# EAGLE design hardware-ble-led-driver-ws2812 (EAGLE 9.6.0)
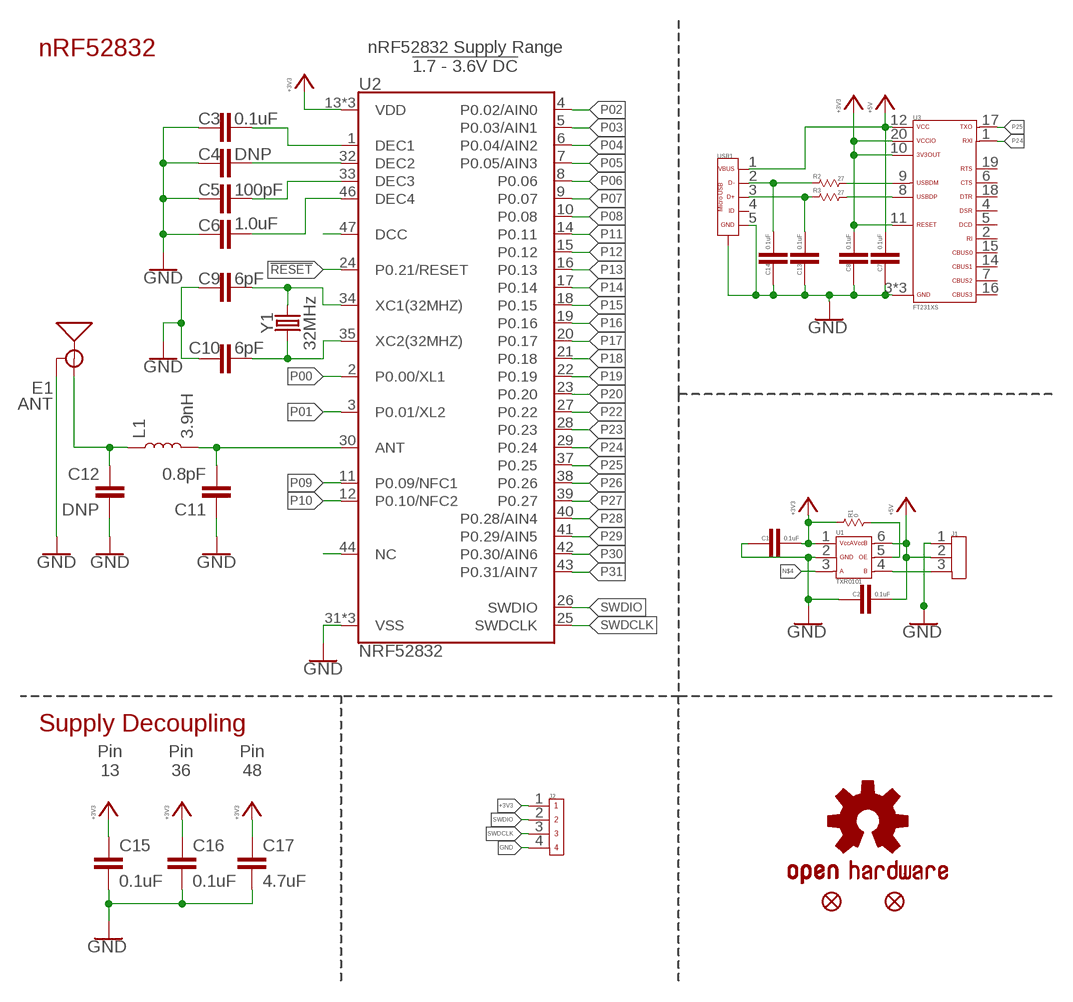
[diagram p0: schematic, sheet 1]

## Parts
C1  0.1uF  0.1UF-0402-16V-10%  [0402]
C2  0.1uF  0.1UF-0402-16V-10%  [0402]
C3  0.1uF  0.1UF-0402-16V-10%  [0402]
C4  DNP  CAP0402  [0402]
C5  100pF  100PF-0402-50V-5%  [0402]
C6  1.0uF  1.0UF-0402-16V-10%  [0402]
C7  0.1uF  0.1UF-0402-16V-10%  [0402]
C8  0.1uF  0.1UF-0402-16V-10%  [0402]
C9  6pF  6PF-0402-50V-0.5%  [0402]
C10  6pF  6PF-0402-50V-0.5%  [0402]
C11  0.8pF  0.8PF-0402-50V-0.1PF  [0402]
C12  DNP  CAP0402  [0402]
C13  0.1uF  0.1UF-0402-16V-10%  [0402]
C14  0.1uF  0.1UF-0402-16V-10%  [0402]
C15  0.1uF  0.1UF-0402-16V-10%  [0402]
C16  0.1uF  0.1UF-0402-16V-10%  [0402]
C17  4.7uF  4.7UF0603  [0603]
E1  ANT  ANTENNA-GROUNDEDTRACE-15.2MM  [TRACE_ANTENNA_2.4GHZ_15.2MM]
FD1  FIDUCIALUFIDUCIAL  [FIDUCIAL-MICRO]
FD2  FIDUCIALUFIDUCIAL  [FIDUCIAL-MICRO]
J1  3PIN_HEADER_PITCH2.54MM_TH  [3PIN_HEADER_PITCH2.54MM_TH]
J2  4PIN_HEADER_PITCH1.27MM_TH  [4PIN_HEADER_PITCH1.27MM_TH]
L1  3.9nH  INDUCTOR-0402-3.9NH  [0402]
LOGO1  OSHW-LOGOMINI  [OSHW-LOGO-MINI]
R1  0  RESISTOR_0402  [0402]
R2  27  RESISTOR_0402  [0402]
R3  27  RESISTOR_0402  [0402]
U1  TXB0101-DCK  [TSSOP-6]
U2  NRF52832  [QFN48-6X6MM]
U3  FT231XS_WFQFN20  [WFQFN-20]
USB1  USB-2.0-MICRO_SMD_SMD  [MICRO-USB-B-SMD-SMD]
Y1  32MHz  CRYSTAL-32MHZ-SMD-2.0X1.6MM  [CRYSTAL-SMD-2.0X1.6MM]

## Nets
!RESET!: U2.24(P0.21/RESET)
+3V3: C1.2 C8.2 C15.1 C16.1 C17.1 J2.1 R1.1 U1.1 U2.13(VDD) U2.36(VDD) U2.48(VDD) U3.10(3V3OUT) U3.11(RESET) U3.20(VCCIO)
+5V: C2.2 C7.2 J1.2 U1.6 U3.12(VCC) USB1.1(VBUS)
ANT: C11.2 L1.2 U2.30(ANT)
DCC: U2.47(DCC)
DEC1: C3.2 U2.1(DEC1)
DEC2: C4.2 U2.32(DEC2)
DEC3: C5.2 U2.33(DEC3)
DEC4: C6.2 U2.46(DEC4)
GND: C1.1 C2.1 C3.1 C4.1 C5.1 C6.1 C7.1 C8.1 C9.1 C10.2 C11.1 C12.2 C13.1 C14.1 C15.2 C16.2 C17.2 E1.GND J1.1 J2.4 U1.2 U2.31(VSS) U2.45(VSS) U2.EP(VSS) U3.3(GND) U3.13(GND) U3.T(GND) USB1.5(GND) USB1.M1(SHIELD) USB1.M2(SHIELD) USB1.M3(SHIELD) USB1.M4(SHIELD) USB1.S1(SHIELD) USB1.S2(SHIELD)
N$1: R2.2 U3.9(USBDM)
N$2: R1.2 U1.5
N$3: R3.2 U3.8(USBDP)
N$4: U1.3
N$5: J1.3 U1.4
N$9: C13.2 R3.1 USB1.3(D+)
N$10: C14.2 R2.1 USB1.2(D-)
N$11: C12.1 E1.ANT(SIGNAL) L1.1
NC: U2.44(NC)
P00: U2.2(P0.00/XL1)
P01: U2.3(P0.01/XL2)
P02: U2.4(P0.02/AIN0)
P03: U2.5(P0.03/AIN1)
P04: U2.6(P0.04/AIN2)
P05: U2.7(P0.05/AIN3)
P06: U2.8(P0.06)
P07: U2.9(P0.07)
P08: U2.10(P0.08)
P09: U2.11(P0.09/NFC1)
P10: U2.12(P0.10/NFC2)
P11: U2.14(P0.11)
P12: U2.15(P0.12)
P13: U2.16(P0.13)
P14: U2.17(P0.14)
P15: U2.18(P0.15)
P16: U2.19(P0.16)
P17: U2.20(P0.17)
P18: U2.21(P0.18)
P19: U2.22(P0.19)
P20: U2.23(P0.20)
P22: U2.27(P0.22)
P23: U2.28(P0.23)
P24: U2.29(P0.24) U3.1(RXD)
P25: U2.37(P0.25) U3.17(TXD)
P26: U2.38(P0.26)
P27: U2.39(P0.27)
P28: U2.40(P0.28/AIN4)
P29: U2.41(P0.29/AIN5)
P30: U2.42(P0.30/AIN6)
P31: U2.43(P0.31/AIN7)
SWDCLK: J2.3 U2.25(SWDCLK)
SWDIO: J2.2 U2.26(SWDIO)
XC1: C9.2 U2.34(XC1(32MHZ)) Y1.3
XC2: C10.1 U2.35(XC2(32MHZ)) Y1.1
Unconnected: U3.2(RI) U3.4(DSR) U3.5(DCD) U3.6(CTS) U3.7(CBUS2) U3.14(CBUS1) U3.15(CBUS0) U3.16(CBUS3) U3.18(DTR) U3.19(RTS) USB1.4(ID)

## Notes on the sheet
- nRF52832
- nRF52832 Supply Range
  !1.7 - 3.6V DC!
- Supply Decoupling
- Pin
  13
- Pin
  36
- Pin
  48

## Library data of the parts
C1-C3 C7 C8 C13-C16 = SparkFun-Capacitors:0.1UF: 0.1µF ceramic capacitors A capacitor is a passive two-terminal electrical component used to store electrical energy temporarily in an electric field.; PROD_ID: CAP-12416
C4 C12 = SparkFun-Passives:CAP: Capacitor Standard 0603 ceramic capacitor, and 0.1" leaded capacitor.
C5 = nrf52832-breakout-temp:100PF: 100pF/0.1nF ceramic capacitors A capacitor is a passive two-terminal electrical component used to store electrical energy temporarily in an electric field.; PROD_ID: CAP-13458
C6 = SparkFun-Capacitors:1.0UF: 1µF ceramic capacitors A capacitor is a passive two-terminal electrical component used to store electrical energy temporarily in an electric field.; PROD_ID: CAP-12417
C9 C10 = nrf52832-breakout-temp:6PF: 15pF ceramic capacitors A capacitor is a passive two-terminal electrical component used to store electrical energy temporarily in an electric field.; PROD_ID: CAP-13455
C11 = nrf52832-breakout-temp:0.8PF: 0.8pF ceramic capacitors A capacitor is a passive two-terminal electrical component used to store electrical energy temporarily in an electric field.; PROD_ID: CAP-13456
C17 = SparkFun-Capacitors:4.7UF: 4.7µF ceramic capacitors A capacitor is a passive two-terminal electrical component used to store electrical energy temporarily in an electric field.; PROD_ID: CAP-08280
E1 = SparkFun-RF:ANTENNA-GROUNDED: Antenna w/ Ground Connection 2.4GHz antennae with signal and ground terminals. TRACE_ANTENNA_2.4GHZ_15.2MM - Meander Trace antenna 15.2 x 5.7mm footprint Based on layout from TI app note AN043 <http://www.ti.com/lit/an/swra117d/swra117d.pdf>. TRACE_ANTENNA_2.4GHZ_25.7MM - Inverted F trace antenna 25.7 x 7.5 mm footprint. Based on layout from TI design note DN0007 <http://www.ti.com/lit/an/swru120b/swru120b.pdf>.
FD1 FD2 = SparkFun-Aesthetics:FIDUCIAL: Fiducial Alignment Points Point-of-reference for pick-and-place machines and other optical instruments.
J1 = Connectors:3PIN
J2 = Connectors:4PIN
L1 = nrf52832-breakout-temp:INDUCTOR: Inductors Resist changes in electrical current. Basically a coil of wire. SparkFun Products: SparkFun Load Cell Amplifier - HX711 <https://www.sparkfun.com/products/13879> IOIO-OTG - V2.2 <https://www.sparkfun.com/products/13613>; PROD_ID: NDUC-13457
LOGO1 = SparkFun-Aesthetics:OSHW-LOGO: Open-Source Hardware (OSHW) Logo This logo indicates the piece of hardware it is found on incorporates a OSHW license and/or adheres to the definition of open source hardware found here: http://freedomdefined.org/OSHW
R1-R3 = Resistors:RESISTOR
U1 = Level-Shifters:TXB0101
U2 = SparkFun-RF:NRF52832: Nordic nRF52832 Bluetooth Smart/ANT/2.4GHz RF SoC The nRF52832 SoC is a powerful, highly flexible ultra-low power multiprotocol SoC ideally suited for Bluetooth® Smart ANT and 2.4GHz ultra low-power wireless applications. The nRF52832 SoC is built around a 32-bit ARM® Cortex™-M4F CPU with 512kB + 64kB RAM. The embedded 2.4GHz transceiver supports Bluetooth Smart, ANT and proprietary 2.4 GHz protocol stack. It is on air compatible with the nRF51 Series, nRF24L and nRF24AP Series products from Nordic Semiconductor. Datasheet <https://cdn.sparkfun.com/datasheets/Wireless/Bluetooth/nRF52832_PS_v1.0.pdf> SparkFun Products: SparkFun nRF52832 Breakout <https://www.sparkfun.com/products/13990>; PROD_ID: IC-13460
U3 = FTDI:FT231XS
USB1 = Connectors:USB-2.0-MICRO
Y1 = nrf52832-breakout-temp:CRYSTAL-32MHZ: 32MHz Crystal Digikey Example <http://www.digikey.com/product-detail/en/murata-electronics-north-america/XRCGB32M000F2P00R0/490-9769-1-ND/4952013> Frequency: 32MHz Frequency Stability: ±20ppm Frequency Tolerance: ±20ppm Load Capacitance: 6pF; PROD_ID: XTAL-13459

## Board
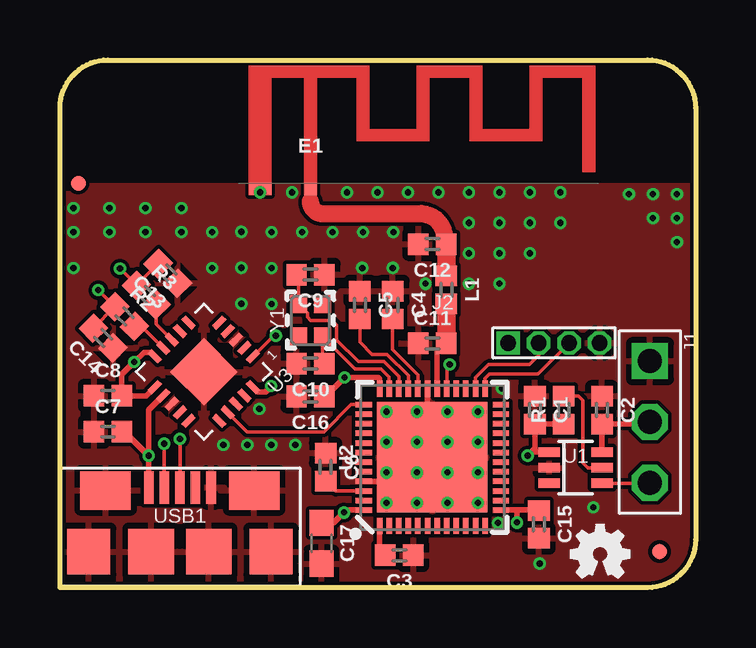
[diagram p1: board, top side]
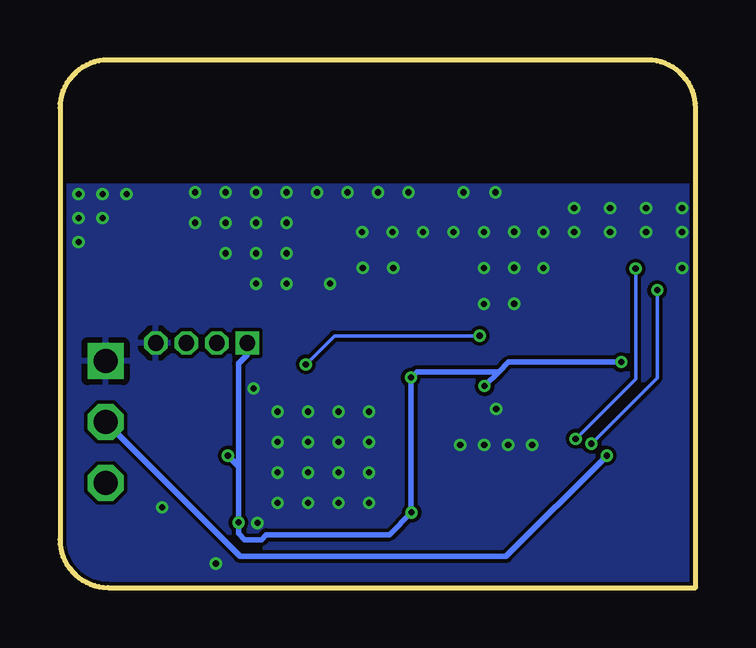
[diagram p2: board, bottom side, seen from below]

Size 26.5 x 22 mm. Coordinates in mm from the lower left corner, seen from the top.
Outline: 0,0 0,20 arc-90 2,22 24.5,22 arc-90 26.5,20 26.5,2 arc-90 24.5,0 0,0
Copper layers (1*16): Top 0.035mm / dielectric 1.5mm / Bottom 0.035mm
Design rules "SparkFun-2-layer-FAB-LIMIT *": minimum track width 4mil, minimum drill 6mil, track to track 6mil, track to pad 6mil, pad to pad 6mil, via to via 6mil, smd to smd 6mil, copper to edge 4mil, drill to drill 4mil, minimum pad ring 5mil, minimum via ring 5mil, stop-mask expansion 4mil, vias tented up to drill 25mil, thermal gap 10mil
tRestrict: 2 lines

### Footprints (pad centres in the part's own frame; a part is rotated, then mirrored left to right if it is on the bottom)
0402 = smd 0.85 x 0.9: 1 -0.58,0; 2 0.58,0
0603 = smd 1.1 x 1: 1 -0.85,0; 2 0.85,0
TRACE_ANTENNA_2.4GHZ_15.2MM = smd 0.5 x 0.5: ANT 0,-0.25 | smd 0.9 x 0.5: GND -2.1,-0.25
FIDUCIAL-MICRO = smd 0.635 x 0.635: 1 0,0
3PIN_HEADER_PITCH2.54MM_TH = drill 1 square: 1 -2.54,0 | drill 1 octagon: 2 0,0; 3 2.54,0
4PIN_HEADER_PITCH1.27MM_TH = drill 0.65 pad 0.9 square: 1 -1.905,0 | drill 0.65 pad 0.9 octagon: 2 -0.635,0; 3 0.635,0; 4 1.905,0
TSSOP-6 = smd 0.4 x 0.9: 1 -0.65,-1.1; 2 0,-1.1; 3 0.65,-1.1; 4 0.65,1.1; 5 0,1.1; 6 -0.65,1.1
QFN48-6X6MM = smd 0.68 x 0.23: 1 -2.86,2.2; 2 -2.86,1.8; 3 -2.86,1.4; 4 -2.86,1; 5 -2.86,0.6; 6 -2.86,0.2; 7 -2.86,-0.2; 8 -2.86,-0.6; 9 -2.86,-1; 10 -2.86,-1.4; 11 -2.86,-1.8; 12 -2.86,-2.2; 25 2.86,-2.2; 26 2.86,-1.8; 27 2.86,-1.4; 28 2.86,-1; 29 2.86,-0.6; 30 2.86,-0.2; 31 2.86,0.2; 32 2.86,0.6; 33 2.86,1; 34 2.86,1.4; 35 2.86,1.8; 36 2.86,2.2 | smd 0.23 x 0.68: 13 -2.2,-2.86; 14 -1.8,-2.86; 15 -1.4,-2.86; 16 -1,-2.86; 17 -0.6,-2.86; 18 -0.2,-2.86; 19 0.2,-2.86; 20 0.6,-2.86; 21 1,-2.86; 22 1.4,-2.86; 23 1.8,-2.86; 24 2.2,-2.86; 37 2.2,2.86; 38 1.8,2.86; 39 1.4,2.86; 40 1,2.86; 41 0.6,2.86; 42 0.2,2.86; 43 -0.2,2.86; 44 -0.6,2.86; 45 -1,2.86; 46 -1.4,2.86; 47 -1.8,2.86; 48 -2.2,2.86 | smd 4.6 x 4.6: EP 0,0
WFQFN-20 = smd 0.6 x 0.254: 1 -1.9,1; 2 -1.9,0.5; 3 -1.9,0; 4 -1.9,-0.5; 5 -1.9,-1; 11 1.9,-1; 12 1.9,-0.5; 13 1.9,0; 14 1.9,0.5; 15 1.9,1 | smd 0.254 x 0.6: 6 -1,-1.9; 7 -0.5,-1.9; 8 0,-1.9; 9 0.5,-1.9; 10 1,-1.9; 16 1,1.9; 17 0.5,1.9; 18 0,1.9; 19 -0.5,1.9; 20 -1,1.9 | smd 2 x 2: T 0,0
MICRO-USB-B-SMD-SMD = smd 0.4 x 1.35: 1 -1.3,2.675; 2 -0.65,2.675; 3 0,2.675; 4 0.65,2.675; 5 1.3,2.675 | smd 2.1 x 1.6: M1 -3.1,2.55; M2 3.1,2.55 | smd 1.8 x 1.9: M3 -3.8,0; M4 3.8,0 | smd 1.9 x 1.9: S1 -1.2,0; S2 1.2,0
CRYSTAL-SMD-2.0X1.6MM = smd 0.75 x 0.7: 1 -0.675,-0.5; 2 0.675,-0.5; 3 0.675,0.5; 4 -0.675,0.5

### Placement (x,y rotation side)
C1  19.8,7.4 270 top
C2  22.6,7.4 270 top
C3  14.15,1.35 180 top
C4  13.87,11.78 270 top
C5  12.5,11.78 270 top
C6  11.08,5.03 270 top
C7  2,6.5 0 top
C8  2,8 0 top
C9  10.45,13.05 180 top
C10  10.45,9.34 180 top
C11  15.53,10.18 0 top
C12  15.53,14.32 180 top
C13  4.5,13.1 135 top
C14  1.8,10.4 135 top
C15  19.97,2.64 270 top
C16  10.45,7.97 180 top
C17  10.9,1.85 270 top
E1  10.45,16.86 0 top
FD1  25,1.5 0 top
FD2  0.76,16.86 0 top
J1  24.6,6.9 270 top
J2  20.6,10.2 0 top
L1  16.11,12.41 270 top
LOGO1  22.52,1.41 0 top
R1  21,7.4 90 top
R2  2.7,11.3 315 top
R3  3.6,12.2 315 top
U1  21.5,5 270 top
U2  15.53,5.43 90 top
U3  6,9 225 top
USB1  5,1.5 0 top
Y1  10.45,11.14 90 top

### Tracks (layer width: path | path; a pad name or v marks a point on that pad's centre or on a via)
+3V3  (via drill 0.25)
  Top 0.229: U2.13 19.06,3.23 | 19.06,3.23 19.96,3.23 C15.1 | v19.06,2.71 19.06,3.23 | U2.36 13.32,8.69 13.26,8.76 v11.87,8.76 11.08,7.97 C16.1 | U2.48 11.94,3.23 v11.84,3.13 11.41,2.7 C17.1 | U3.20 8.26,8.15 8.57,8.15 8.8,8.39 v8.8,8.4 | U3.10 3.79,9.8 3.5,9.8 v3.1,9.4 2.58,8.88 C8.2 3.59,8 U3.11 | 19.95,5.65 U1.1 19.65,5.65 | R1.1 C1.2 19.8,5.8 19.65,5.65 | v19.5,5.5 19.65,5.65
  Bottom 0.229: v3.1,9.4 7.8,9.4 8.2,9 | 8.2,9 v8.8,8.4 | 8.2,9 11.62,9 v11.87,8.76 11.87,3.15 v11.84,3.13 12.77,2.2 17.9,2.2 18.1,2 18.8,2 19.06,2.26 v19.06,2.71 19.06,5.06 | v19.5,5.5 19.06,5.06 | J2.1 18.7,9.7 19.06,9.34 19.06,5.06
+5V  (via drill 0.25)
  Top 0.229: U3.12 3.7,7.41 v3.7,5.5 | v3.7,5.5 USB1.1 | C7.2 2.7,6.5 v3.7,5.5 | J1.2 24.52,6.82 C2.2 U1.6
  Bottom 0.229: J1.2 19,1.3 7.9,1.3 v3.7,5.5
ANT
  Top 0.229: U2.30 15.72,9.8 C11.2
  Top 0.762: C11.2 L1.2
DEC1
  Top 0.229: U2.1 13.32,1.59 C3.2
DEC2
  Top 0.152: U2.32 14.93,8.88 13.87,9.93 C4.2
DEC3
  Top 0.152: U2.33 14.53,8.84 13.64,9.72 13.01,9.72 12.5,10.23 C5.2
DEC4
  Top 0.152: U2.46 11.5,4.03 C6.2
GND  (via drill 0.25)
  Top 0.152: 15.32,5.63 v14.89,6.07
  Top 0.229: U2.31 15.32,5.63 U2.EP | U2.45 14.53,4.43 v14.89,4.79
  other vias: 8.35,16.48 12.6,13.33 13.87,13.33 15.25,12.67 17.05,12.67 7.56,14.83 18.27,2.69 20,1 16.16,4.79 16.16,3.52 16.16,6.07 16.16,7.33 14.89,7.33 14.89,3.52 13.62,3.52 13.62,4.79 13.62,6.07 13.62,7.33 17.43,7.33 17.43,6.07 17.43,4.79 17.43,3.52 9.81,5.95 25.73,16.4 6.35,14.83 5.06,14.82 17.05,13.94 17.05,15.21 17.05,16.48 15.78,16.48 14.51,16.48 13.24,16.48 11.97,16.48 13.9,14.83 12.63,14.83 11.36,14.83 9.68,16.48 18.32,12.67 18.32,13.94 18.32,15.21 18.32,16.48 19.59,16.48 20.86,16.48 10.09,14.83 8.82,14.83 19.59,13.94 19.59,15.21 20.86,15.21 22.24,3.34 8.31,7.45 3.56,14.82 2.06,14.82 0.56,14.82 8.82,13.33 7.56,13.33 6.35,13.33 3.56,15.82 5.06,15.82 2.06,15.82 0.56,15.82 7.56,11.83 8.82,11.83 0.56,13.32 8.81,5.95 7.81,5.95 6.81,5.95 18.43,8.3 24.73,16.4 25.73,15.4 23.73,16.4 24.73,15.4 25.73,14.4
  pour Top (isolate 0.152): 26.5,16.73 0,16.73 0,0 24.5,0 arc90 26.5,2
  pour Bottom (isolate 0.152): 26.5,16.73 0,16.73 0,0 24.5,0 arc90 26.5,2
N$1
  Top 0.152: U3.9 3.4,10.89 R2.2
N$2
  Top 0.152: R1.2 21.62,7.98 21.8,7.8 21.8,5.2 22,5 U1.5
N$3
  Top 0.152: U3.8 4.01,10.99 R3.2
N$5
  Top 0.152: U1.4 J1.3
N$9  (via drill 0.25)
  Top 0.152: USB1.3 v5,6.2 | C13.2 R3.1 v2.5,13.3
  Bottom 0.152: v5,6.2 2.5,8.7 v2.5,13.3
N$10  (via drill 0.25)
  Top 0.152: USB1.2 v4.35,6 | C14.2 R2.1 v1.6,12.4
  Bottom 0.152: v4.35,6 1.6,8.75 v1.6,12.4
N$11
  Top 0.508: E1.ANT 10.45,16.1
  Top 0.711: 10.45,16.1 arc90 10.95,15.59 15.02,15.59 arc-90 16.05,14.56 16.05,14.32 C12.1
  Top 0.762: L1.1 C12.1
P24  (via drill 0.25)
  Top 0.152: U2.29 16.12,9.18 v16.25,9.3 | v9,10.5 8.91,10.5 U3.1
  Bottom 0.152: v16.25,9.3 15.05,10.5 v9,10.5
P25
  Top 0.152: U2.37 12.13,7.63 11,6.5 7.79,6.5 U3.17
P31
  Top 0.152: U2.43 12.66,5.23
SWDCLK
  Top 0.152: U2.25 17.73,8.72 17.9,8.9 19.94,8.9 J2.3
SWDIO
  Top 0.152: U2.26 17.32,8.76 17.87,9.3 19.56,9.3 19.96,9.7 J2.2
XC1
  Top 0.152: U2.34 14.12,8.81 13.52,9.42 12.45,9.42 11.54,10.33 11.54,10.94 11.33,11.14 10.45,11.14 10.32,11.27 10.32,11.45 Y1.3 9.95,12.97 C9.2
XC2
  Top 0.152: U2.35 13.72,8.78 13.39,9.11 12.3,9.11 Y1.1 10.95,9.34 C10.1

### Text on the board
Measures: Units in inches